# EAGLE design v100_ripping (EAGLE 6.0)
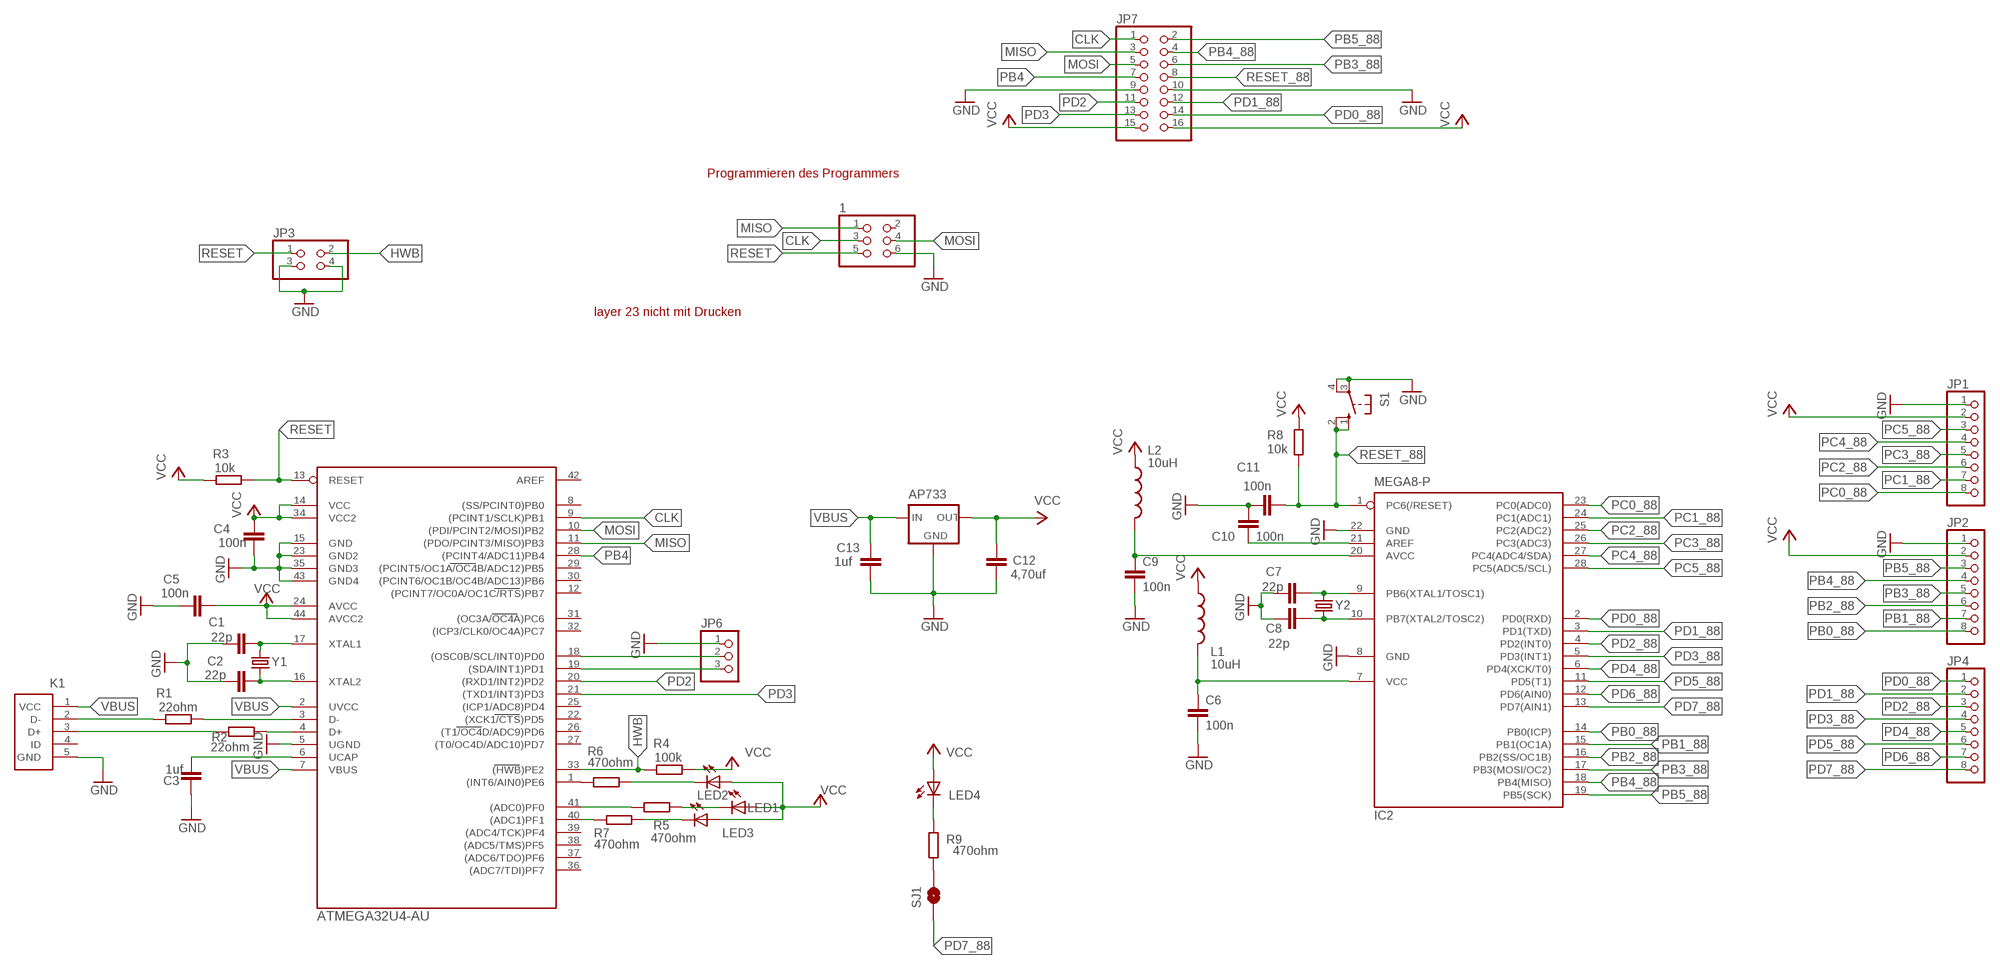
[diagram p0: schematic, sheet 1]

## Parts
1  PINHD-2X3  [2X03]
C1  22p  C-EUC0805  [C0805]
C2  22p  C-EUC0805  [C0805]
C3  1uf  C-EUC0805  [C0805]
C4  100n  C-EUC0805  [C0805]
C5  100n  C-EUC0805  [C0805]
C6  100n  CAP0805  [0805]
C7  22p  C-EUC0805  [C0805]
C8  22p  C-EUC0805  [C0805]
C9  100n  CAP0805  [0805]
C10  100n  CAP0805  [0805]
C11  100n  CAP0805  [0805]
C12  4,70uf  C-EUC0805  [C0805]
C13  1uf  C-EUC0805  [C0805]
IC1  ATMEGA32U4-AU  [TQFP44]
IC2  MEGA8-P  [DIL28-3]
JP1  PINHD-1X8  [1X08]
JP2  PINHD-1X8  [1X08]
JP3  PINHD-2X2  [2X02]
JP4  PINHD-1X8  [1X08]
JP6  PINHD-1X3  [1X03]
JP7  PINHD-2X8  [2X08]
K1  65100516121  [65100516121]
L1  10uH  INDUCTOR0805  [0805]
L2  10uH  INDUCTOR0805  [0805]
LED1  LED_LEDCHIP-LED0805  [LED_CHIP-LED0805]
LED2  LED_LEDCHIP-LED0805  [LED_CHIP-LED0805]
LED3  LED_LEDCHIP-LED0805  [LED_CHIP-LED0805]
LED4  LED_LEDCHIP-LED0805  [LED_CHIP-LED0805]
R1  22ohm  R-EU_R0805  [R0805]
R2  22ohm  R-EU_R0805  [R0805]
R3  10k  R-EU_R0805  [R0805]
R4  100k  R-EU_R0805  [R0805]
R5  470ohm  R-EU_R0805  [R0805]
R6  470ohm  R-EU_R0805  [R0805]
R7  470ohm  R-EU_R0805  [R0805]
R8  10k  R-EU_R0805  [R0805]
R9  470ohm  R-EU_R0805  [R0805]
S1  SWITCH-OMRON_10-XX  [SWITCH-OMRON_B3F-10XX]
SJ1  SOLDERJUMPERTRACE  [SJ_2S-TRACE]
U$2  AP733  [AP733]
Y1  CRYSTALSMD  [HC49UP]
Y2  CRYSTALSMD  [HC49UP]

## Nets
CLK: 1.3 IC1.9((PCINT1/SCLK)PB1) JP7.1
D+: K1.3(D+) R2.2
D-: K1.2(D-) R1.2
GND: 1.6 C1.1 C2.1 C3.1 C4.1 C5.2 C6.2 C7.1 C8.1 C9.2 C10.1 C11.1 C12.2 C13.2 IC1.5(UGND) IC1.15(GND) IC1.23(GND2) IC1.35(GND3) IC1.43(GND4) IC2.8(GND) IC2.22(GND) JP1.1 JP2.1 JP3.3 JP3.4 JP6.1 JP7.9 JP7.10 K1.5(GND) S1.3(P) S1.4(P1) U$2.3(GND)
HWB: IC1.33((HWB)PE2) JP3.2 R4.2
MISO: 1.1 IC1.11((PDO/PCINT3/MISO)PB3) JP7.3
MOSI: 1.4 IC1.10((PDI/PCINT2/MOSI)PB2) JP7.5
N$1: IC1.3(D-) R1.1
N$2: IC1.4(D+) R2.1
N$3: C2.2 IC1.16(XTAL2) Y1.1
N$4: C1.2 IC1.17(XTAL1) Y1.2
N$5: C3.2 IC1.6(UCAP)
N$6: C7.2 IC2.9(PB6(XTAL1/TOSC1)) Y2.2
N$7: IC1.1((INT6/AIN0)PE6) R6.2
N$8: LED4.C R9.1
N$9: LED1.C R5.1
N$10: IC1.40((ADC1)PF1) R7.2
N$11: R9.2 SJ1.2
N$12: IC1.41((ADC0)PF0) R5.2
N$13: C8.2 IC2.10(PB7(XTAL2/TOSC2)) Y2.1
N$14: C9.1 IC2.20(AVCC) L2.2
N$15: C6.1 IC2.7(VCC) L1.2
N$16: C10.2 IC2.21(AREF)
N$17: IC1.19((SDA/INT1)PD1) JP6.3
N$21: LED2.C R6.1
N$22: IC1.18((OSC0B/SCL/INT0)PD0) JP6.2
N$23: LED3.C R7.1
PB0_88: IC2.14(PB0(ICP)) JP2.8
PB1_88: IC2.15(PB1(OC1A)) JP2.7
PB2_88: IC2.16(PB2(SS/OC1B)) JP2.6
PB3_88: IC2.17(PB3(MOSI/OC2)) JP2.5 JP7.6
PB4: IC1.28((PCINT4/ADC11)PB4) JP7.7
PB4_88: IC2.18(PB4(MISO)) JP2.4 JP7.4
PB5_88: IC2.19(PB5(SCK)) JP2.3 JP7.2
PC0_88: IC2.23(PC0(ADC0)) JP1.8
PC1_88: IC2.24(PC1(ADC1)) JP1.7
PC2_88: IC2.25(PC2(ADC2)) JP1.6
PC3_88: IC2.26(PC3(ADC3)) JP1.5
PC4_88: IC2.27(PC4(ADC4/SDA)) JP1.4
PC5_88: IC2.28(PC5(ADC5/SCL)) JP1.3
PD0_88: IC2.2(PD0(RXD)) JP4.1 JP7.14
PD1_88: IC2.3(PD1(TXD)) JP4.2 JP7.12
PD2: IC1.20((RXD1/INT2)PD2) JP7.11
PD2_88: IC2.4(PD2(INT0)) JP4.3
PD3: IC1.21((TXD1/INT3)PD3) JP7.13
PD3_88: IC2.5(PD3(INT1)) JP4.4
PD4_88: IC2.6(PD4(XCK/T0)) JP4.5
PD5_88: IC2.11(PD5(T1)) JP4.6
PD6_88: IC2.12(PD6(AIN0)) JP4.7
PD7_88: IC2.13(PD7(AIN1)) JP4.8 SJ1.1
RESET: 1.5 IC1.13(RESET) JP3.1 R3.1
RESET_88: C11.2 IC2.1(PC6(/RESET)) JP7.8 R8.1 S1.1(S) S1.2(S1)
VBUS: C13.1 IC1.2(UVCC) IC1.7(VBUS) K1.1(VCC) U$2.1(IN)
VCC: C4.2 C5.1 C12.1 IC1.14(VCC) IC1.24(AVCC) IC1.34(VCC2) IC1.44(AVCC2) JP1.2 JP2.2 JP7.15 JP7.16 L1.1 L2.1 LED1.A LED2.A LED3.A LED4.A R3.2 R4.1 R8.2 U$2.2(OUT)
Unconnected: 1.2 IC1.8((SS/PCINT0)PB0) IC1.12((PCINT7/OC0A/OC1C/RTS)PB7) IC1.22((XCK1/CTS)PD5) IC1.25((ICP1/ADC8)PD4) IC1.26((T1/OC4D/ADC9)PD6) IC1.27((T0/OC4D/ADC10)PD7) IC1.29((PCINT5/OC1A/OC4B/ADC12)PB5) IC1.30((PCINT6/OC1B/OC4B/ADC13)PB6) IC1.31((OC3A/OC4A)PC6) IC1.32((ICP3/CLK0/OC4A)PC7) IC1.36((ADC7/TDI)PF7) IC1.37((ADC6/TDO)PF6) IC1.38((ADC5/TMS)PF5) IC1.39((ADC4/TCK)PF4) IC1.42(AREF) K1.4(ID)

## Notes on the sheet
- Programmieren des Programmers
- layer 23 nicht mit Drucken

## Library data of the parts
1 = pinhead:PINHD-2X3: PIN HEADER
C1-C5 C7 C8 C12 C13 = rcl:C-EU: CAPACITOR, European symbol
C6 C9-C11 = SparkFun-Passives:CAP: Capacitor Standard 0603 ceramic capacitor, and 0.1" leaded capacitor.
IC1 = mega32U4:ATMEGA32U4-AU
IC2 = atmel:MEGA8-P: MICROCONTROLLER 8 Kbytes FLASH, 1 kbytes SRAM, 512 bytes EEPROM, USART, 4-channel 10 bit ADC, 2-channel 8 bit ADC Pin compatible with Atmega48, ATMega88, ATMega168 Source: avr.lbr; OC_FARNELL: unknown; OC_NEWARK: unknown
JP1 JP2 JP4 = pinhead:PINHD-1X8: PIN HEADER
JP3 = pinhead:PINHD-2X2: PIN HEADER
JP6 = pinhead:PINHD-1X3: PIN HEADER
JP7 = pinhead:PINHD-2X8: PIN HEADER
K1 = Wuerth_Elektronik_eiCan_11_Communication_Connectors_v1_2:65100516121: WR-COM SMT Horizontal 5 Contacts Mini USB Typ B
L1 L2 = SparkFun-Passives:INDUCTOR: Inductors Basic Inductor/Choke - 0603 and 1206. Footprints are not proven and vary greatly between part numbers.
LED1-LED4 = at90usb1287_octopus:LED_LED: LED OSRAM: - CHIPLED LG R971, LG N971, LY N971, LG Q971, LY Q971, LO R971, LY R971 LH N974, LH R974 LS Q976, LO Q976, LY Q976 LO Q996 - Hyper CHIPLED LW Q18S LB Q993, LB Q99A, LB R99A - SideLED LS A670, LO A670, LY A670, LG A670, LP A670 LB A673, LV A673, LT A673, LW A673 LH A674 LY A675 LS A676, LA A676, LO A676, LY A676, LW A676 LS A679, LY A679, LG A679 - Hyper Micro SIDELED® LS Y876, LA Y876, LO Y876, LY Y876 LT Y87S - SmartLED LW L88C, LW L88S LB L89C, LB L89S, LG L890 LS L89K, LO L89K, LY L89K LS L896, LA L896, LO L896, LY L896 - TOPLED LS T670, LO T670, LY T670, LG T670, LP T670 LSG T670, LSP T670, LSY T670, LOP T670, LYG T670 LG T671, LOG T671, LSG T671 LB T673, LV T673, LT T673, LW T673 LH T674 LS T676, LA T676, LO T676, LY T676, LB T676, LH T676, LSB T676, LW T676 LB T67C, LV T67C, LT T67C, LS T67K, LO T67K, LY T67K, LW E67C LS E67B, LA E67B, LO E67B, LY E67B, LB E67C, LV E67C, LT E67C LW T67C LS T679, LY T679, LG T679 LS T770, LO T770, LY T770, LG T770, LP T770 LB T773, LV T773, LT T773, LW T773 LH T774 LS E675, LA E675, LY E675, LS T675 LS T776, LA T776, LO T776, LY T776, LB T776 LHGB T686 LT T68C, LB T68C - Hyper Mini TOPLED® LB M676 - Mini TOPLED Santana® LG M470 LS M47K, LO M47K, LY M47K Source: http://www.osram.convergy.de LUXEON: - LUMILED® LXK2-PW12-R00, LXK2-PW12-S00, LXK2-PW14-U00, LXK2-PW14-V00 LXK2-PM12-R00, LXK2-PM12-S00, LXK2-PM14-U00 LXK2-PE12-Q00, LXK2-PE12-R00, LXK2-PE12-S00, LXK2-PE14-T00, LXK2-PE14-U00 LXK2-PB12-K00, LXK2-PB12-L00, LXK2-PB12-M00, LXK2-PB14-N00, LXK2-PB14-P00, LXK2-PB14-Q00 LXK2-PR12-L00, LXK2-PR12-M00, LXK2-PR14-Q00, LXK2-PR14-R00 LXK2-PD12-Q00, LXK2-PD12-R00, LXK2-PD12-S00 LXK2-PH12-R00, LXK2-PH12-S00 LXK2-PL12-P00, LXK2-PL12-Q00, LXK2-PL12-R00 Source: www.luxeon.com KINGBRIGHT: KA-3528ASYC Source: www.kingbright.com
R1-R9 = rcl:R-EU_: RESISTOR, European symbol
S1 = at90usb1287_octopus:SWITCH-OMRON_10-XX: OMRON SWITCH; MPN: B3F-1000; OC_FARNELL: 176432; OC_NEWARK: 36M3542
SJ1 = SparkFun:SOLDERJUMPER: Solder Jumper Standard SMD solder jumper. Used to automate production. Two varients : Normally Open and Normally Closed are the same, but have different paste layers. NC will have a large amount of paste and should jumper during reflow.
U$2 = lp733:AP733
Y1 Y2 = SparkFun-FreqCtrl:CRYSTAL: Various standard crystals. Proven footprints. Spark Fun Electronics SKU : COM-00534

## Board
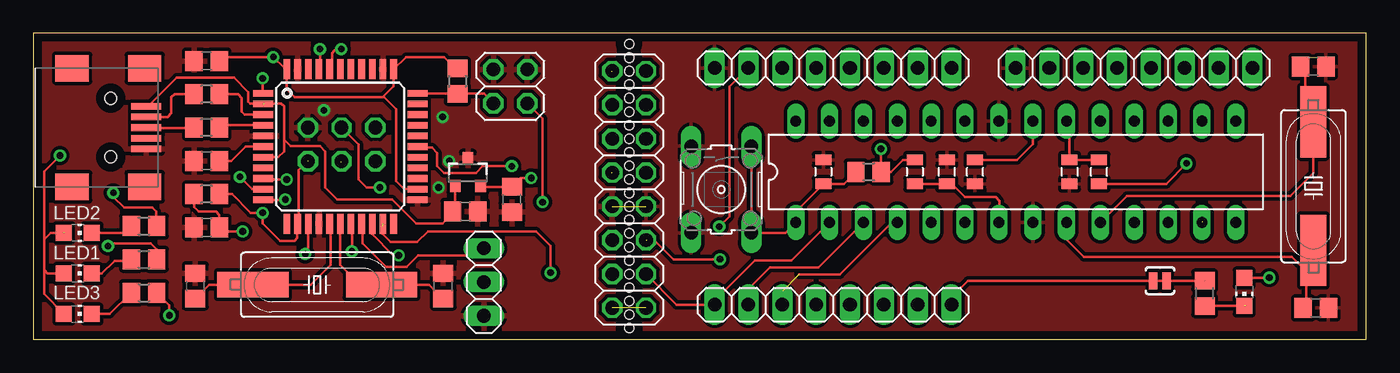
[diagram p1: board, top side]
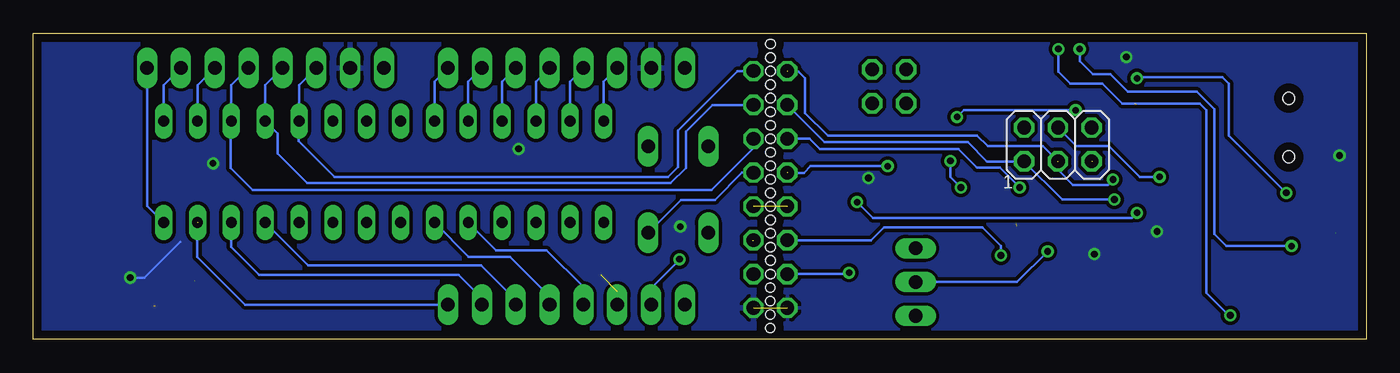
[diagram p2: board, bottom side, seen from below]

Size 100 x 22.98 mm. Coordinates in mm from the lower left corner, seen from the top.
Outline: 0,0 100,0 100,22.98 0,22.98 0,0
Copper layers (1*16): Top 0.035mm / dielectric 1.5mm / Bottom 0.035mm
Design rules: minimum track width 0.2mm, minimum drill 19mil, track to track 10mil, track to pad 10mil, pad to pad 10mil, via to via 10mil, smd to smd 0mil, copper to edge 25mil, drill to drill 8mil, minimum pad ring 10mil, minimum via ring 8mil, stop-mask expansion 4mil, vias tented up to drill 20mil, thermal gap 10mil
Holes 0.7 mm at 44.71,0.84 44.71,1.85 44.71,2.88 44.71,3.88 44.7,4.9 44.7,5.93 44.7,6.93 44.7,7.96 44.7,8.96 44.7,9.98 44.7,10.99 44.7,12.01 44.7,14.05 44.7,13.03 44.7,15.06 44.7,16.08 44.7,17.09 44.7,18.11 44.7,19.12 44.7,20.14 44.7,21.15 44.7,22.17

### Footprints (pad centres in the part's own frame; a part is rotated, then mirrored left to right if it is on the bottom)
2X03 = drill 1.016 octagon: 1 -2.54,-1.27; 2 -2.54,1.27; 3 0,-1.27; 4 0,1.27; 5 2.54,-1.27; 6 2.54,1.27
C0805 = smd 1.3 x 1.5: 1 -0.95,0; 2 0.95,0
0805 = smd 0.8 x 1.2: 1 -0.9,0; 2 0.9,0
TQFP44 = smd 1.5 x 0.5: 1 -5.8,4; 2 -5.8,3.2; 3 -5.8,2.4; 4 -5.8,1.6; 5 -5.8,0.8; 6 -5.8,0; 7 -5.8,-0.8; 8 -5.8,-1.6; 9 -5.8,-2.4; 10 -5.8,-3.2; 11 -5.8,-4; 23 5.8,-4; 24 5.8,-3.2; 25 5.8,-2.4; 26 5.8,-1.6; 27 5.8,-0.8; 28 5.8,0; 29 5.8,0.8; 30 5.8,1.6; 31 5.8,2.4; 32 5.8,3.2; 33 5.8,4 | smd 0.5 x 1.5: 12 -4,-5.8; 13 -3.2,-5.8; 14 -2.4,-5.8; 15 -1.6,-5.8; 16 -0.8,-5.8; 17 0,-5.8; 18 0.8,-5.8; 19 1.6,-5.8; 20 2.4,-5.8; 21 3.2,-5.8; 22 4,-5.8; 34 4,5.8; 35 3.2,5.8; 36 2.4,5.8; 37 1.6,5.8; 38 0.8,5.8; 39 0,5.8; 40 -0.8,5.8; 41 -1.6,5.8; 42 -2.4,5.8; 43 -3.2,5.8; 44 -4,5.8
DIL28-3 = drill 0.813 long: 1 -16.51,-3.81; 2 -13.97,-3.81; 3 -11.43,-3.81; 4 -8.89,-3.81; 5 -6.35,-3.81; 6 -3.81,-3.81; 7 -1.27,-3.81; 8 1.27,-3.81; 9 3.81,-3.81; 10 6.35,-3.81; 11 8.89,-3.81; 12 11.43,-3.81; 13 13.97,-3.81; 14 16.51,-3.81; 15 16.51,3.81; 16 13.97,3.81; 17 11.43,3.81; 18 8.89,3.81; 19 6.35,3.81; 20 3.81,3.81; 21 1.27,3.81; 22 -1.27,3.81; 23 -3.81,3.81; 24 -6.35,3.81; 25 -8.89,3.81; 26 -11.43,3.81; 27 -13.97,3.81; 28 -16.51,3.81
1X08 = drill 1.016 long: 1 -8.89,0; 2 -6.35,0; 3 -3.81,0; 4 -1.27,0; 5 1.27,0; 6 3.81,0; 7 6.35,0; 8 8.89,0
2X02 = drill 1.016 octagon: 1 -1.27,-1.27; 2 -1.27,1.27; 3 1.27,-1.27; 4 1.27,1.27
1X03 = drill 1.016 long: 1 -2.54,0; 2 0,0; 3 2.54,0
2X08 = drill 1.016 octagon: 1 -8.89,-1.27; 2 -8.89,1.27; 3 -6.35,-1.27; 4 -6.35,1.27; 5 -3.81,-1.27; 6 -3.81,1.27; 7 -1.27,-1.27; 8 -1.27,1.27; 9 1.27,-1.27; 10 1.27,1.27; 11 3.81,-1.27; 12 3.81,1.27; 13 6.35,-1.27; 14 6.35,1.27; 15 8.89,-1.27; 16 8.89,1.27
65100516121 = smd 0.5 x 2.25: 1 -1.6,5.685; 2 -0.8,5.685; 3 0,5.685; 4 0.8,5.685; 5 1.6,5.685 | smd 2 x 2.5: Z1 -4.45,5.56; Z2 4.45,5.56; Z3 4.45,0.11; Z4 -4.45,0.11 | hole 0.9: -2.2,3.01; 2.2,3.01
LED_CHIP-LED0805 = smd 1.2 x 1.2: A 0,-1.05; C 0,1.05
R0805 = smd 1.3 x 1.5: 1 -0.95,0; 2 0.95,0
SWITCH-OMRON_B3F-10XX = drill 1.016 long: 1 -3.251,2.261; 2 3.251,2.261; 3 -3.251,-2.261; 4 3.251,-2.261
SJ_2S-TRACE = smd 0.635 x 1.27: 1 -0.508,0; 2 0.508,0
AP733 = smd 0.8 x 0.9: 1 -0.95,-1; 2 0.95,-1; 3 0,1.1
HC49UP = smd 5.334 x 1.93: 1 -4.826,0; 2 4.826,0

### Placement (x,y rotation side)
1  23.13,14.63 0 bottom
C1  30.75,4 270 top
C2  12.15,4 270 top
C3  13,13.4 0 top
C4  13,8.4 0 top
C5  13,20.9 180 top
C6  68.54,12.58 90 top
C7  96.22,2.36 180 top
C8  96.03,20.48 180 top
C9  77.74,12.58 270 top
C10  70.66,12.58 90 top
C11  59.27,12.58 270 top
C12  35.9,10.5 270 top
C13  32.4,9.6 0 top
IC1  23.03,14.47 0 top
IC2  73.71,12.58 0 top
JP1  60,20.38 0 top
JP2  82.58,20.38 0 top
JP3  35.79,19 90 top
JP4  60,2.6 0 top
JP6  33.8,4.3 90 top
JP7  44.7,11.25 270 top
K1  2.8,15.9 270 top
L1  66.12,12.58 270 top
L2  79.95,12.58 90 top
LED1  3.35,4.95 270 top
LED2  3.35,7.99 270 top
LED3  3.35,1.9 270 top
LED4  90.85,3.55 180 top
R1  13,18.4 180 top
R2  13,15.9 180 top
R3  13,10.9 180 top
R4  31.83,19.38 270 top
R5  8.3,6 0 top
R6  8.3,8.5 0 top
R7  8.3,3.5 0 top
R8  62.67,12.58 0 top
R9  87.88,3.45 90 top
S1  51.61,11.25 270 top
SJ1  84.53,4.4 0 top
U$2  32.6,12.5 0 top
Y1  21.3,4.1 0 top
Y2  96.04,11.5 270 top

### Tracks (layer width: path | path; a pad name or v marks a point on that pad's centre or on a via)
CLK  (via drill 0.5)  (2 unrouted)
  Top 0.2: v19,12 17.3,12 IC1.9
  Bottom 0.2: 19.2,11.8 v19,12 19.4,11.6 22,11.6 23.1,12.7 23.1,13.3 | 1.3 24.27,14.5 28.4,14.5 29.2,15.3 40.4,15.3 42.1,17 42.1,19.6 42.6,20.1 43.4,20.1
D+
  Top 0.2: K1.3 8.51,15.88 12.07,15.88 | R2.2 12.07,15.88 | 12.07,15.88 12.11,15.88
D-
  Top 0.2: K1.2 10.09,16.7 10.36,16.97 10.36,18.17 10.59,18.4 R1.2
GND  (via drill 0.5)  (1 unrouted)
  Bottom 0.2: v21.8,17.2 30.2,17.2 v30.7,16.7 | v30.4,11.4 31.2,12.2 v31.2,13.4
  pour Top: -2.82,36.87 44.38,30.56 43.92,-11.86 -2.37,-3.08
  pour Top: 45.35,33.29 117.88,33.28 104.4,-5.6 45.15,-3.49
HWB
  Top 0.2: IC1.33 28.87,18.43 R4.2 33.81,18.43 JP3.2
MISO  (via drill 0.5)
  Top 0.2: IC1.11 18.87,10.47 v18.9,10.5
  Bottom 0.2: v18.9,10.5 22.81,10.5 1.1 28.46,13.36 29.9,14.8 40.63,14.8 JP7.3
MOSI  (via drill 0.5)
  Top 0.2: IC1.10 16.43,11.27 v15.5,12.2 | 1.4 24.4,14.63 24.4,12 25,11.4 v26,11.4
  Bottom 0.2: v15.5,12.2 17,12.2 19.3,14.5 21.73,14.5 1.4 | JP7.5 41.76,15.06 41,14.3 30.6,14.3 29.2,12.9 27.5,12.9 v26,11.4
N$1
  Top 0.2: IC1.3 15.87,16.87 15.63,17.11 15.63,18.12 15.64,18.13 15.37,18.4 R1.1
N$2
  Top 0.2: R2.1 14.12,16.07 IC1.4
N$3
  Top 0.2: C2.2 13.2,4.1 Y1.1 20.8,4.1 22.3,5.6 22.3,8.6 IC1.16
N$4
  Top 0.2: C1.2 29.7,4.1 Y1.2 24.5,4.1 23,5.6 23,8.64 IC1.17
N$5
  Top 0.2: C3.2 14.86,13.4 15.93,14.47 IC1.6
N$6
  Top 0.2: C7.2 95.49,2.58 95.49,5.1 | 95.49,5.1 96.04,5.65 Y2.2 | IC2.9 77.52,7.5 78.82,6.2 78.82,6.19 94.4,6.19 95.49,5.1
N$7  (via drill 0.5)
  Top 0.2: 9.25,8.75 R6.2 9.2,8.55 9.2,9.6 8.9,9.9 6.8,9.9 6,10.7 v6,11 | v17.2,19.6 17.2,18.5 IC1.1
  Bottom 0.2: v17.2,19.6 17.1,19.7 10.8,19.7 10.3,19.2 10.3,15.3 v6,11
N$8  (1 unrouted)
  Top 0.2: R9.1 90.96,2.5 90.97,2.51
N$9
  Top 0.2: LED1.C 5.15,4.95 6.1,5.9 7.25,5.9 R5.1
N$10  (via drill 0.5)
  Top 0.2: IC1.40 22.23,20.83 22.4,21 22.4,21.5 22.6,21.7 v23.1,21.8 | R7.2 10.2,2.55 v10.2,1.8
  Bottom 0.2: v23.1,21.8 23.1,20.1 22.2,19.2 19.8,19.2 18.3,17.7 12.5,17.7 12,17.2 12,3.5 10.3,1.8 v10.2,1.8
N$11  (1 unrouted)
  Top 0.2: SJ1.2 87.93,4.4 87.93,4.44 87.89,4.44 R9.2 87.88,4.38 87.92,4.38 87.92,4.39
N$12  (via drill 0.5)
  Top 0.2: IC1.41 21.5,20.34 v21.5,21.8 | R5.2 9.25,6.75 8.8,7.2 5.8,7.2 v5.6,7
  Bottom 0.2: v21.5,21.8 21.5,20.9 20.5,19.9 19.2,19.9 17.9,18.6 12.7,18.6 11.4,17.3 11.4,7.9 10.5,7 v5.6,7
N$13
  Top 0.2: C8.2 95.43,20.13 95.43,16.37 95.47,16.33 Y2.1 96.04,12.5 94.3,10.76 82.05,10.76 IC2.10
N$14
  Top 0.2: IC2.20 77.74,16.17 C9.1 L2.2
N$15
  Top 0.2: L1.2 C6.1 68.9,11.68 69.91,10.67 72.2,10.67 72.49,10.38 72.49,8.82 IC2.7
N$16
  Top 0.2: C10.2 73.81,13.48 74.98,14.65 IC2.21
N$17
  Top 0.2: IC1.19 24.7,8.6 24.7,7.19 26.46,5.43 27.99,5.43 28.86,6.3 33.26,6.3 JP6.3
N$21
  Top 0.2: LED2.C 6.84,7.99 R6.1
N$22  (via drill 0.5)
  Top 0.2: v23.9,6.6 23.9,8.6 IC1.18
  Bottom 0.2: JP6.2 26.2,4.3 v23.9,6.6
N$23
  Top 0.2: LED3.C 5.75,1.9 R7.1
PB0_88
  Bottom 0.2: IC2.14 91.47,10.02 JP2.8
PB1_88
  Bottom 0.2: JP2.7 90.22,19.09 IC2.15
PB2_88
  Bottom 0.2: JP2.6 87.68,19.09 IC2.16
PB3_88
  Bottom 0.2: JP2.5 85.14,19.09 IC2.17 85.21,16.32 85.21,12.86 83.55,11.2 49.13,11.2 45.97,14.36 JP7.6
PB4  (via drill 0.5)  (1 unrouted)
  Top 0.2: v35.9,13 33.7,13 33.2,12.5 30.8,12.5 30.3,13 30.3,14 29.9,14.4 28.9,14.4 IC1.28
  Bottom 0.2: v35.9,13 41.7,13 42.2,12.5 43.4,12.5
PB4_88
  Bottom 0.2: JP2.4 82.6,19.09 IC2.18 81.68,15.47 81.68,13.95 79.45,11.72 52.19,11.72 51.04,12.87 51.04,15.61 49.05,17.6 JP7.4
PB5_88
  Bottom 0.2: JP2.3 80.06,19.09 IC2.19 80.09,16.36 80.09,14.89 77.38,12.18 52.39,12.18 51.65,12.92 51.65,15.66 47.17,20.14 JP7.2
PC0_88
  Bottom 0.2: JP1.8 69.9,19.37 IC2.23
PC1_88
  Bottom 0.2: JP1.7 67.36,19.37 IC2.24
PC2_88
  Bottom 0.2: JP1.6 64.82,19.37 IC2.25
PC3_88
  Bottom 0.2: JP1.5 62.28,19.37 IC2.26
PC4_88
  Bottom 0.2: JP1.4 59.74,19.37 IC2.27
PC5_88
  Bottom 0.2: JP1.3 57.2,19.37 IC2.28
PD0_88
  Top 0.2: JP7.14 48.27,2.6 JP4.1 51.11,2.88 54.14,5.91 56.88,5.91 IC2.2
PD1_88  (via drill 0.5)  (1 unrouted)
  Top 0.2: IC2.3 58.9,5.39 55.27,5.39 53.65,3.77 JP4.2 | v51.52,6.01 48.04,6.01 46.61,7.44 46.04,7.44 45.96,7.52
  Bottom 0.2: v51.52,6.01 51.52,5.95 53.65,3.82 JP4.2
PD2  (via drill 0.5)
  Top 0.2: IC1.20 25.4,8.64 25.4,7.9 27,6.3 v27.4,6.3
  Bottom 0.2: JP7.11 37.16,7.44 36.2,8.4 28.8,8.4 27.4,7 v27.4,6.3
PD2_88  (1 unrouted)
  Top 0.2: 56.19,3.61 JP4.3 | IC2.4 64.41,8.77 60.51,4.87 57.45,4.87
PD3  (via drill 0.5)  (1 unrouted)
  Top 0.2: 26.2,8.7 IC1.21 | JP7.13 42.9,4.9 | 26.2,8.5 26.2,7.9 26.8,7.3 28.8,7.3 29.6,8.1 37.7,8.1 38.8,7 v38.8,5
  Bottom 0.2: v38.8,5 38.9,4.9 JP7.13
PD3_88
  Bottom 0.2: IC2.5 65.28,6.69 61.5,6.69 58.73,3.92 JP4.4
PD4_88
  Bottom 0.2: IC2.6 67.33,6.2 64.24,6.2 61.27,3.23 JP4.5
PD5_88
  Bottom 0.2: IC2.11 79.38,5.55 66.39,5.55 63.81,2.97 JP4.6
PD6_88
  Bottom 0.2: JP4.7 66.35,3.09 68.09,4.83 83.06,4.83 85.15,6.92 IC2.12
PD7_88  (1 unrouted)
  Top 0.2: SJ1.1 70.11,4.4 68.89,3.18 JP4.8
  Bottom 0.2: JP4.8 84.09,2.6 87.69,6.2 87.69,8.82 87.6,8.91
RESET  (via drill 0.5)  (1 unrouted)
  Top 0.2: 20.6,13.4 19.9,12.7 19.9,8.74 IC1.13 19.8,8.64 19.8,7.6 19.6,7.4 18.5,7.4 17.2,8.7 v17.2,9.5 16.3,9.5 14.9,10.9 R3.1 | JP3.1 38.2,16.59 v38.2,10.3
  Bottom 0.2: v38.2,10.3 37,9.1 17.6,9.1 v17.2,9.5
RESET_88
  Top 0.2: R8.1 60.82,11.68 C11.2 57.2,9.61 IC2.1 56.43,8 S1.2 S1.1
  Bottom 0.2: JP7.8 46.83,12.52 48.87,10.48 51.39,10.48 S1.2
VBUS  (1 unrouted)
  Top 0.2: K1.1 8.63,17.5 10.77,19.64 15.05,19.64 16.12,18.57 16.12,17.84 16.27,17.69 17.36,17.69 17.44,17.61 17.53,17.7 18.6,17.7 18.8,17.5 18.8,15 | 18.8,15 18.8,14.1 18.37,13.67 IC1.7 | 18.8,15 19.3,14.5 21.5,14.5 21.9,14.1 21.9,11.4 22.8,10.5 26.9,10.5 28.7,8.7 30.7,8.7 31.45,9.45 C13.1 31.65,9.8 U$2.1
VCC  (via drill 0.5)  (2 unrouted)
  Top 0.2: R4.1 31.77,20.27 30.84,21.2 27.96,21.2 IC1.34 27.03,19.03 26.2,18.2 | LED3.A 0.8,3.39 0.8,5.2 | 0.8,5.2 0.8,7.5 | 0.8,7.5 1.3,8 LED2.A | LED1.A 1.05,4.95 0.8,5.2 | v2,13.8 0.8,12.6 0.8,7.5 | R3.2 12.05,9.95 12.4,9.6 13.7,9.6 13.95,9.35 C4.2 14.25,8.1 v15.7,8.1 | IC1.14 20.6,8.64 20.6,6.9 v20.4,6.4 | 26.2,18.2 19.6,18.2 19,18.8 19,20.24 IC1.44 19.1,20.34 19.1,20.4 | 26.2,18.2 26.3,18.2 27.2,17.3 27.2,11.9 27.8,11.3 28.8,11.3 IC1.24 | U$2.2 33.6,11.45 C12.1 36.55,12.1 v37.35,12.11 | C5.1 14.25,21.2 v18,21.2 18.8,20.4 19.1,20.4 | 19.1,20.4 19.2,20.4 | L1.1 65.24,13.48 64.34,12.58 R8.2 63.59,12.61 v63.59,14.3 | v51.46,8.46 52.24,9.24 52.24,18.97 JP1.2 | L2.1 84.99,11.68 v86.52,13.21 | LED4.A 92.7,4.6 v92.73,4.63
  Bottom 0.2: v92.73,4.63 91.69,4.63 89,7.32
  pour Bottom: -10.26,46.45 44.35,40.82 44.01,-11.27 -10.63,-8.66
  pour Bottom: 44.94,-16.69 127.18,-25.92 123.63,19.51 45.3,29.13

### Text on the board
tValues: Clk | PC5 | PC4 | PC3 | PC2 | PC1 | PC0 | GND | VCC | PB5 | PB4 | PB3 | PB2 | PB1 | PB0 | MISO | GND | VCC | HWB | MOSI | RES | RES | GND | RX | SDA | SCL | TX | PD0 | PD1 | PD2 | PD3 | PD4 | PD5 | PD6 | PD7 | VCC | GND